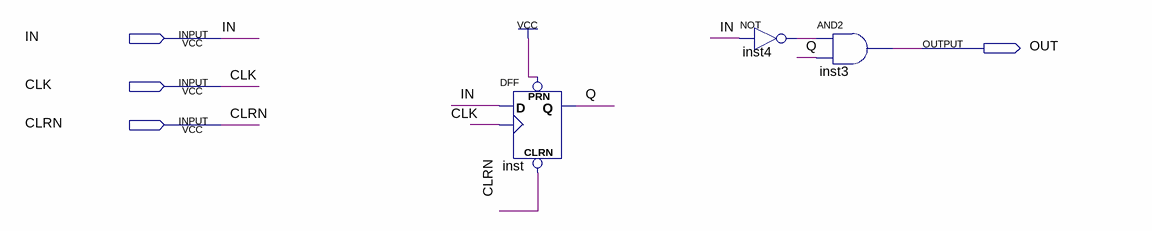
[diagram p0: schematic sheet]
// Quartus schematic edge_det_mealy.bdf as structural Verilog: 3 symbols, 4 pins
module edge_det_mealy (
  input  IN,
  input  CLK,
  input  CLRN,
  output OUT
);

  wire inst4_out, Q;

  DFF inst (.CLRN(CLRN), .CLK(CLK), .D(IN), .PRN(1'b1), .Q(Q));
  not inst4 (inst4_out, IN);
  and inst3 (OUT, inst4_out, Q);
endmodule
